# Altium project Analog_Multiplier.PrjPcb
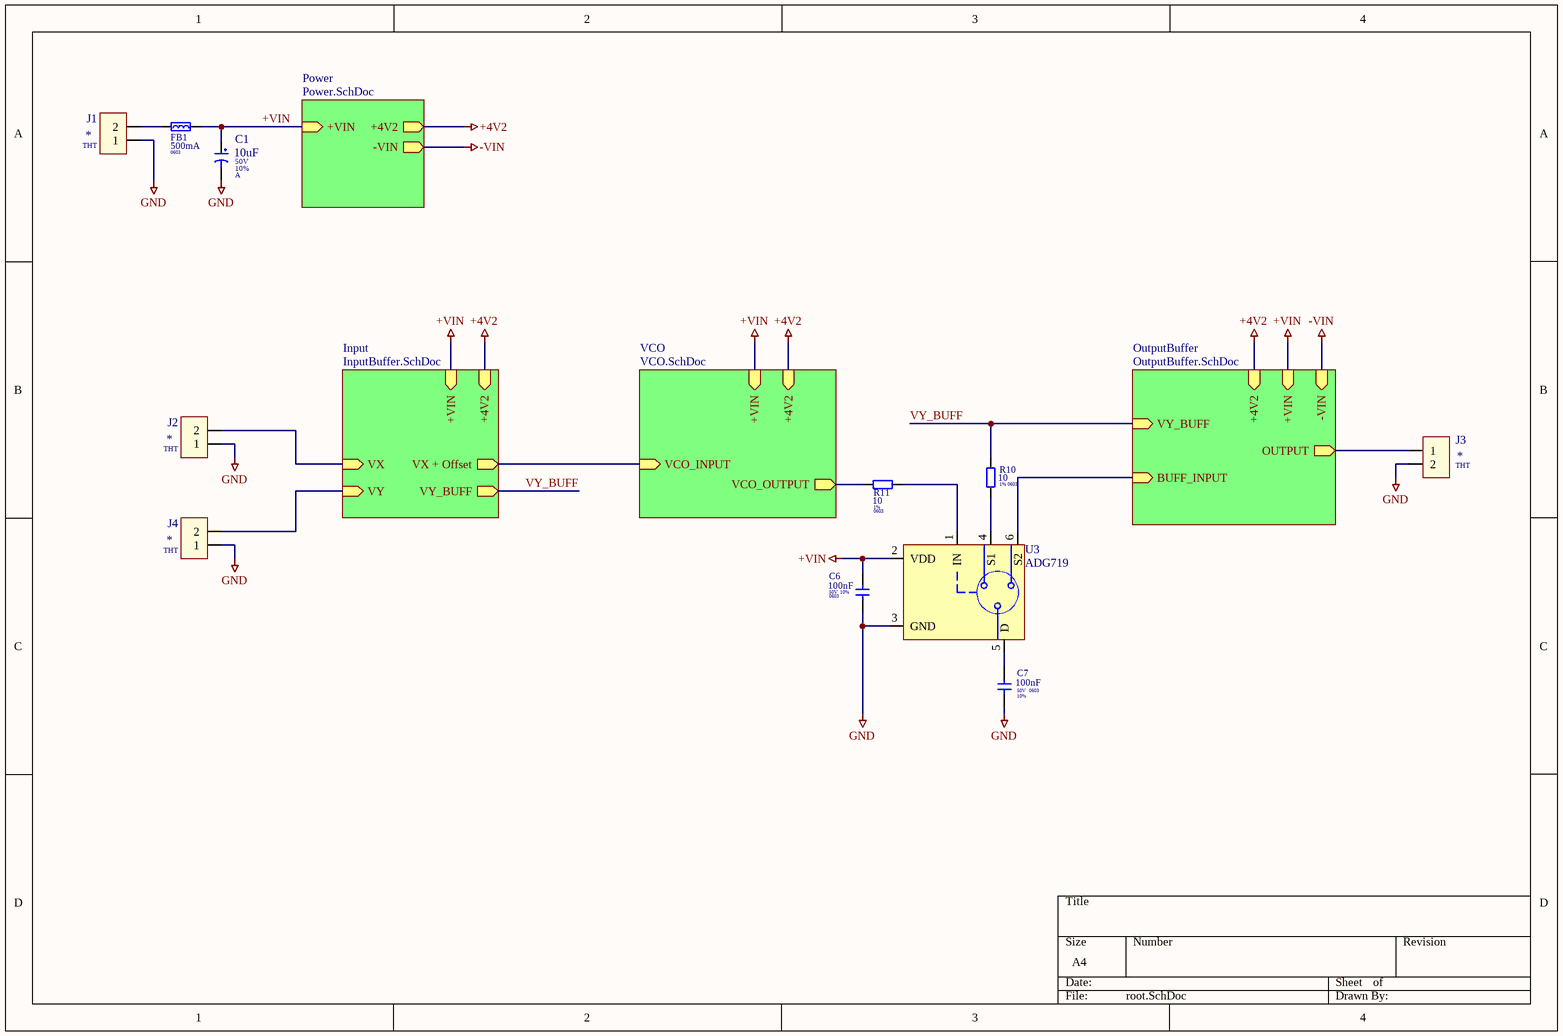
[diagram p0: root.SchDoc]
5 sheets, 67 parts. Net scope: hierarchical (ports join the sheet entries above them; power ports are global).
Sheets:
  root.SchDoc
    VCO = VCO.SchDoc
    Power = Power.SchDoc
    Input = InputBuffer.SchDoc
    OutputBuffer = OutputBuffer.SchDoc

## Sheet root.SchDoc
size A4; SheetNumber: 1; SheetTotal: 6

### Parts
C1  value 10uF  Voltage: 50V  Package: A  Tolerant: 10%  [CAPMP3217X16L]  (hidden comment: 10uF/50V)
C6  value 100nF  Voltage: 50V  Tolerant: 10%  Package: 0603  [CAPC1608X06M]  (hidden comment: 100nF/50V)
C7  value 100nF  Voltage: 50V  Tolerant: 10%  Package: 0603  [CAPC1608X06M]  (hidden comment: 100nF/50V)
FB1  Package: 0603  [INDC2012X07N]  (hidden comment: 500mA)
J1  Package: THT  [ARK2]  (hidden comment: *)
J2  Package: THT  [ARK2]  (hidden comment: *)
J3  Package: THT  [ARK2]  (hidden comment: *)
J4  Package: THT  [ARK2]  (hidden comment: *)
R10  value 10  Package: 0603  Tolerance: 1%  [RESC1608X06L]  (hidden comment: 10 1%)
R11  value 10  Package: 0603  Tolerance: 1%  [RESC1608X06L]  (hidden comment: 10 1%)
U3  ADG719  [SOT363/SC-88]

### Sub-sheets
Input = InputBuffer.SchDoc: VX (in), VX + Offset (out), +4V2 (in), +VIN (in), VY (in), VY_BUFF (out)
OutputBuffer = OutputBuffer.SchDoc: BUFF_INPUT (in), VY_BUFF (in), OUTPUT (out), +4V2 (in), +VIN (in), -VIN (in)
Power = Power.SchDoc: +VIN (in), +4V2 (out), -VIN (out)
VCO = VCO.SchDoc: +4V2 (in), +VIN (in), VCO_INPUT (in), VCO_OUTPUT (out)

### Nets
+4V2: sheet VCO/+4V2, sheet Power/+4V2, sheet Input/+4V2, sheet OutputBuffer/+4V2
+VIN: C1.1 C6.2 FB1.2 U3.2(VDD) ; sheet VCO/+VIN, sheet Power/+VIN, sheet Input/+VIN, sheet OutputBuffer/+VIN
-VIN: sheet Power/-VIN, sheet OutputBuffer/-VIN
GND: C1.2 C6.1 C7.1 J1.1 J2.1 J3.2 J4.1 U3.3(GND)
VY_BUFF: R10.2 ; sheet Input/VY_BUFF, sheet OutputBuffer/VY_BUFF
NetC7_2: C7.2 U3.5(D)
NetC14_1: U3.6(S2) ; sheet OutputBuffer/BUFF_INPUT
NetC17_2: J3.1 ; sheet OutputBuffer/OUTPUT
NetFB1_1: FB1.1 J1.2
NetJ2_2: J2.2 ; sheet Input/VX
NetJ4_2: J4.2 ; sheet Input/VY
NetQ1_2: R11.1 ; sheet VCO/VCO_OUTPUT
NetR4_1: sheet VCO/VCO_INPUT, sheet Input/VX + Offset
NetR10_1: R10.1 U3.4(S1)
NetR11_2: R11.2 U3.1(IN)

### Library data of the parts
C1 = C_TANTAL: WORKPLAN_Code: EP00; manufacture: *; helpurl: *
C6 C7 = C
FB1 = FB: manufacture: *; helpurl: *; value: 500mA
J1-J4 = CON_2PIN: WORKPLAN_Code: EP00; manufacture: *; helpurl: *; value: *
R10 R11 = R
U3 = ADG719: Analogue Switch ICs LOW VOLTAGE SINGEL SPDT; DataSheet: https://www.analog.com/media/en/technical-documentation/data-sheets/ADG719.pdf; Mouser: https://www.mouser.pl/ProductDetail/Analog-Devices/ADG719BRTZ-REEL7?qs=BpaRKvA4VqFaSWmiDs8izg%3D%3D&utm_id=20109199562&gad_source=1&gclid=Cj0KCQiA57G5BhDUARIsACgCYnxDS6CW5NFKHO1UnA1TKx4mLoyVdeZEORDHvH8gi9WRrzOxhw7N7oQaAhUnEALw_wcB; value: ADG719

## Sheet VCO.SchDoc
size A4; SheetNumber: 3; SheetTotal: 5
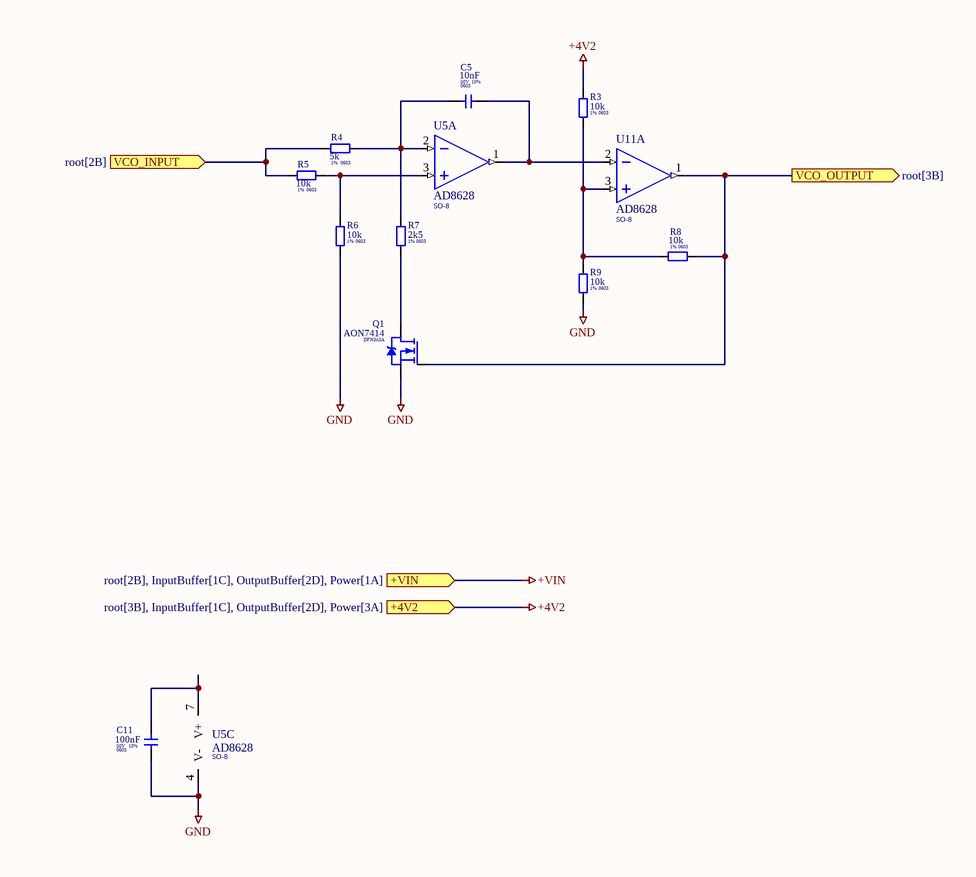
[diagram p1: VCO.SchDoc]

### Parts
C5  value 10nF  Voltage: 50V  Tolerant: 10%  Package: 0603  [CAPC1608X06M]  (hidden comment: 10nF/50V)
C11  value 100nF  Voltage: 50V  Tolerant: 10%  Package: 0603  [CAPC1608X06M]  (hidden comment: 100nF/50V)
Q1  Package: DFN3x3A  [SON65P300X90-3L]  (hidden comment: AON7414)
R3  value 10k  Package: 0603  Tolerance: 1%  [RESC1608X06L]  (hidden comment: 10k 1%)
R4  value 5k  Package: 0603  Tolerance: 1%  [RESC1608X06L]  (hidden comment: 5k 1%)
R5  value 10k  Package: 0603  Tolerance: 1%  [RESC1608X06L]  (hidden comment: 10k 1%)
R6  value 10k  Package: 0603  Tolerance: 1%  [RESC1608X06L]  (hidden comment: 10k 1%)
R7  value 2k5  Package: 0603  Tolerance: 1%  [RESC1608X06L]  (hidden comment: 2k5 1%)
R8  value 10k  Package: 0603  Tolerance: 1%  [RESC1608X06L]  (hidden comment: 10k 1%)
R9  value 10k  Package: 0603  Tolerance: 1%  [RESC1608X06L]  (hidden comment: 10k 1%)
U5  Package: SO-8  [SOIC127P600X170-8N]  (hidden comment: AD8628)  (parts A,C of 3)
U11  Package: SO-8  [SOIC127P600X170-8N]  (hidden comment: AD8628)  (part A of 3)

### Ports
+4V2 (in, see root[3B], InputBuffer[1C], OutputBuffer[2D], Power[3A]), +VIN (in, see root[2B], InputBuffer[1C], OutputBuffer[2D], Power[1A]), VCO_INPUT (in, see root[2B]), VCO_OUTPUT (out, see root[3B])

### Nets
+4V2: R3.2 ; port +4V2
GND: C11.1 Q1.1(S) R6.1 R9.1 U5.4(V-)
NetC5_1: C5.1 R4.2 R7.2 U5.2(IN-)
NetC5_2: C5.2 U5.1(OUT) U11.2(IN-)
NetC11_2: C11.2 U5.7(V+)
NetQ1_2: Q1.2(G) R8.1 U11.1(OUT) ; port VCO_OUTPUT
NetQ1_3: Q1.3(D) R7.1
NetR3_1: R3.1 R8.2 R9.2 U11.3(IN+)
NetR4_1: R4.1 R5.1 ; port VCO_INPUT
NetR5_2: R5.2 R6.2 U5.3(IN+)

### Library data of the parts
C5 C11 = C
Q1 = AON7414: 30V, 15A N-Channel MOSFET; manufacture: https://www.tme.eu/pl/details/aon7414/tranzystory-z-kanalem-n-smd/alpha-omega-semiconductor/; helpurl: https://www.tme.eu/Document/bbe6d91c24f2d151d9c9588885823e7b/AON7414-DTE.pdf; value: AON7414
R3-R9 = R
U5 U11 = AD8628ARZ: Zero-Drift, Single-Supply, Rail-to-Rail Input/Output Operational Amplifier; Manufacture: Analog; helpurl: https://www.analog.com/media/en/technical-documentation/data-sheets/ad8628-8629-8630.pdf; value: AD8628

## Sheet Power.SchDoc
size A4; SheetNumber: 2; SheetTotal: 5
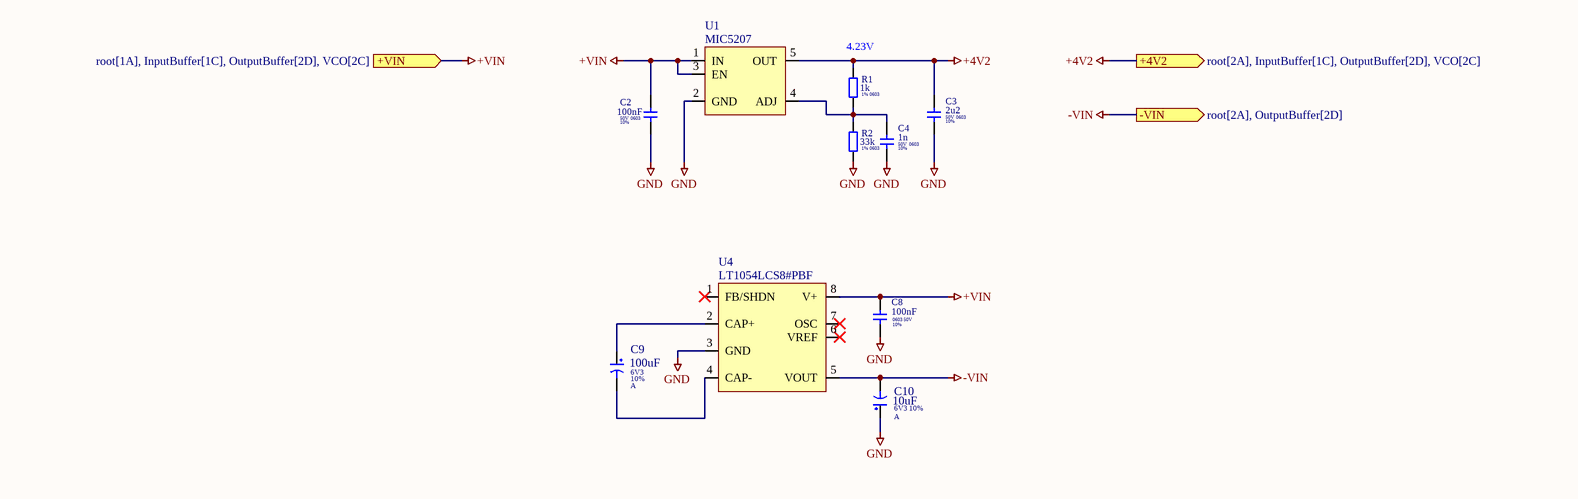
[diagram p2: Power.SchDoc]

### Parts
C2  value 100nF  Voltage: 50V  Tolerant: 10%  Package: 0603  [CAPC1608X06M]  (hidden comment: 100nF/50V)
C3  value 2u2  Voltage: 50V  Tolerant: 10%  Package: 0603  [CAPC1608X06M]  (hidden comment: 2u2/50V)
C4  value 1n  Voltage: 50V  Tolerant: 10%  Package: 0603  [CAPC1608X06M]  (hidden comment: 1n/50V)
C8  value 100nF  Voltage: 50V  Tolerant: 10%  Package: 0603  [CAPC1608X06M]  (hidden comment: 100nF/50V)
C9  value 100uF  Voltage: 6V3  Package: A  Tolerant: 10%  [CAPMP3217X16L]  (hidden comment: 100uF/6V3)
C10  value 10uF  Voltage: 6V3  Package: A  Tolerant: 10%  [CAPMP3217X16L]  (hidden comment: 10uF/6V3)
R1  value 1k  Package: 0603  Tolerance: 1%  [RESC1608X06L]  (hidden comment: 1k 1%)
R2  value 33k  Package: 0603  Tolerance: 1%  [RESC1608X06L]  (hidden comment: 33k 1%)
U1  MIC5207  [SOT95P245X110-5M]
U4  LT1054LCS8#PBF  [SOIC-8]

### Ports
+4V2 (out, see root[2A], InputBuffer[1C], OutputBuffer[2D], VCO[2C]), +VIN (in, see root[1A], InputBuffer[1C], OutputBuffer[2D], VCO[2C]), -VIN (out, see root[2A], OutputBuffer[2D])

### Nets
+4V2: C3.2 R1.2 U1.5(OUT) ; port +4V2
+VIN: C2.2 C8.2 U1.1(IN) U1.3(EN) U4.8(V+) ; port +VIN
-VIN: C10.2 U4.5(VOUT) ; port -VIN
GND: C2.1 C3.1 C4.1 C8.1 C10.1 R2.1 U1.2(GND) U4.3(GND)
NetC4_2: C4.2 R1.1 R2.2 U1.4(ADJ)
NetC9_1: C9.1 U4.2(CAP+)
NetC9_2: C9.2 U4.4(CAP-)

Not connected (* = marked no-connect by the designer): U4 1(FB/SHDN)* 6(VREF)* 7(OSC)*

### Notes on the sheet
- (near R1) 4.23V

### Library data of the parts
C2-C4 C8 = C
C9 C10 = C_TANTAL: WORKPLAN_Code: EP00; manufacture: *; helpurl: *
R1 R2 = R
U1 = MIC5207YM5-TR: 180 mA Low-Noise LDO Regulator; Manufacture: Microchip; helpurl: https://ww1.microchip.com/downloads/aemDocuments/documents/APID/ProductDocuments/DataSheets/MIC5207-180mA-Low-Noise-LDO-Regulator-DS20005719C.pdf; value: MIC5207
U4 = LT1054: Switched-Capacitor Voltage / Converter with Regulator; Manufacturer: AnalogDevices; DataSheet: https://www.mouser.pl/datasheet/2/609/LT1054_1054L-1775938.pdf; Mouser: https://www.mouser.pl/ProductDetail/Analog-Devices/LT1054LCS8PBF?qs=ytflclh7QUUfK4FckUJTaA%3D%3D; value: LT1054LCS8#PBF

## Sheet InputBuffer.SchDoc
size A4; SheetNumber: 4; SheetTotal: 6
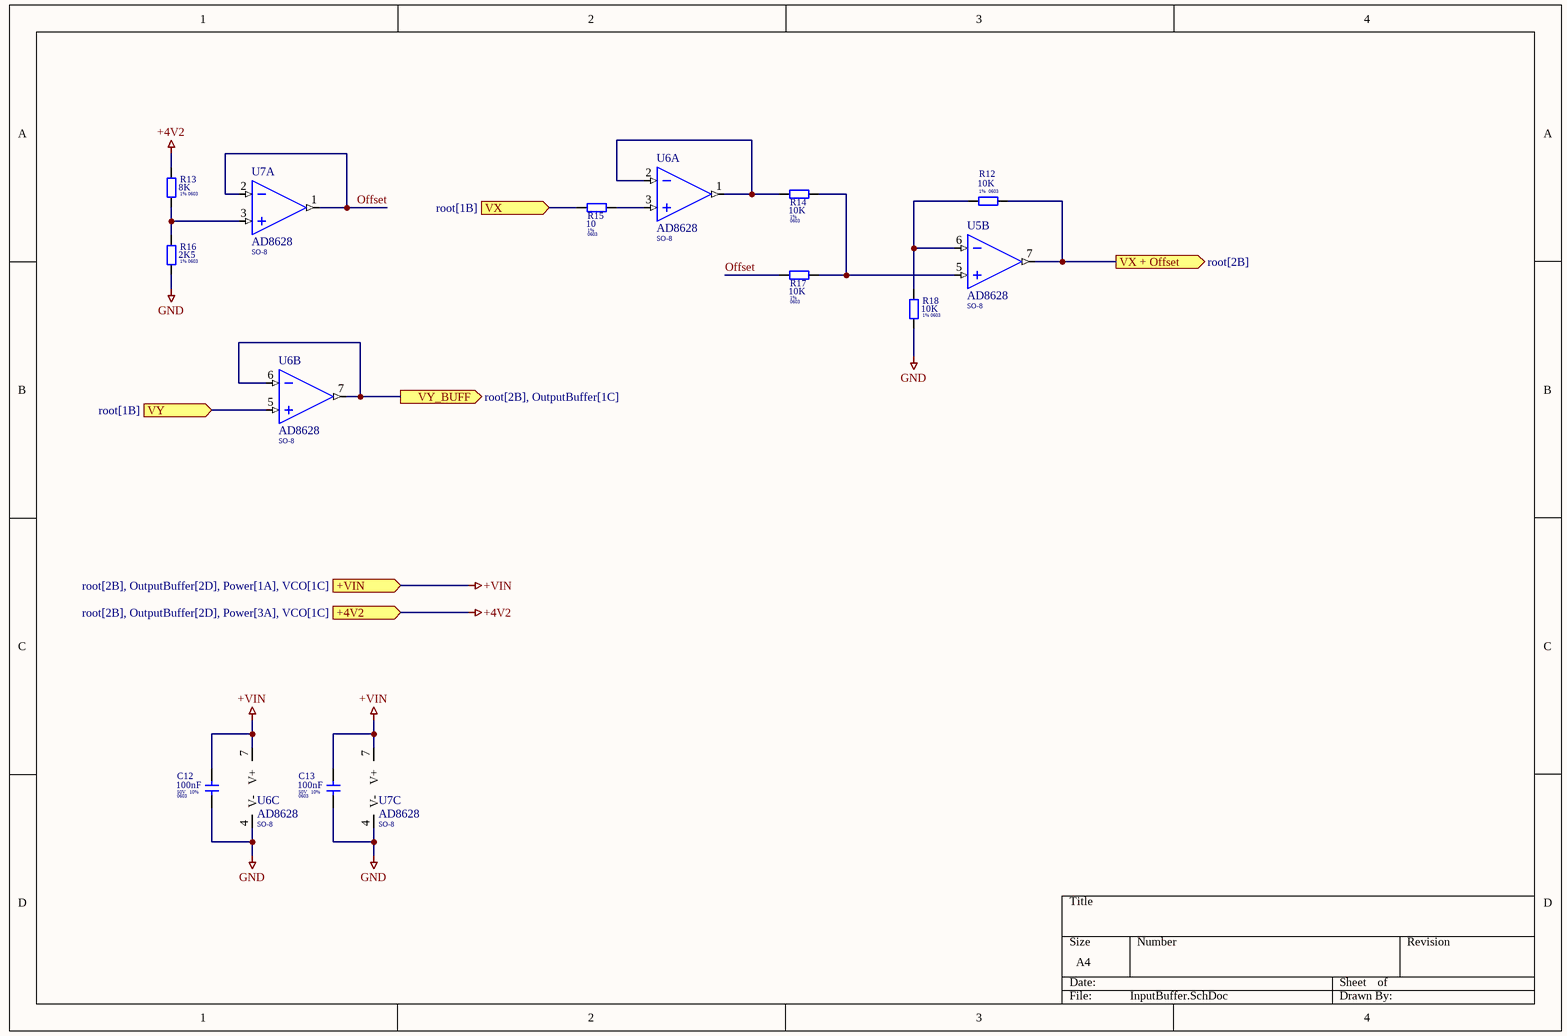
[diagram p3: InputBuffer.SchDoc]

### Parts
C12  value 100nF  Voltage: 50V  Tolerant: 10%  Package: 0603  [CAPC1608X06M]  (hidden comment: 100nF/50V)
C13  value 100nF  Voltage: 50V  Tolerant: 10%  Package: 0603  [CAPC1608X06M]  (hidden comment: 100nF/50V)
R12  value 10K  Package: 0603  Tolerance: 1%  [RESC1608X06L]  (hidden comment: 10K 1%)
R13  value 8K  Package: 0603  Tolerance: 1%  [RESC1608X06L]  (hidden comment: 8K 1%)
R14  value 10K  Package: 0603  Tolerance: 1%  [RESC1608X06L]  (hidden comment: 10K 1%)
R15  value 10  Package: 0603  Tolerance: 1%  [RESC1608X06L]  (hidden comment: 10 1%)
R16  value 2K5  Package: 0603  Tolerance: 1%  [RESC1608X06L]  (hidden comment: 2K5 1%)
R17  value 10K  Package: 0603  Tolerance: 1%  [RESC1608X06L]  (hidden comment: 10K 1%)
R18  value 10K  Package: 0603  Tolerance: 1%  [RESC1608X06L]  (hidden comment: 10K 1%)
U5  Package: SO-8  [SOIC127P600X170-8N]  (hidden comment: AD8628)  (part B of 3)
U6  Package: SO-8  [SOIC127P600X170-8N]  (hidden comment: AD8628)  (parts A,B,C of 3)
U7  Package: SO-8  [SOIC127P600X170-8N]  (hidden comment: AD8628)  (parts A,C of 3)

### Ports
+4V2 (in, see root[2B], OutputBuffer[2D], Power[3A], VCO[1C]), +VIN (in, see root[2B], OutputBuffer[2D], Power[1A], VCO[1C]), VX (in, see root[1B]), VX + Offset (out, see root[2B]), VY (in, see root[1B]), VY_BUFF (out, see root[2B], OutputBuffer[1C])

### Nets
+4V2: R13.2 ; port +4V2
+VIN: C12.2 C13.2 U6.7(V+) U7.7(V+) ; port +VIN
GND: C12.1 C13.1 R16.1 R18.1 U6.4(V-) U7.4(V-)
Offset: R17.1 U7.1(OUT) U7.2(IN-)
VY_BUFF: U6.6(IN-) U6.7(OUT) ; port VY_BUFF
NetJ2_2: R15.1 ; port VX
NetJ4_2: U6.5(IN+) ; port VY
NetR4_1: R12.2 U5.7(OUT) ; port VX + Offset
NetR12_1: R12.1 R18.2 U5.6(IN-)
NetR13_1: R13.1 R16.2 U7.3(IN+)
NetR14_1: R14.1 U6.1(OUT) U6.2(IN-)
NetR14_2: R14.2 R17.2 U5.5(IN+)
NetR15_2: R15.2 U6.3(IN+)

### Library data of the parts
C12 C13 = C
R12-R18 = R
U5-U7 = AD8628ARZ: as U5 on sheet VCO; helpurl: https://www.analog.com/media/en/technical-documentation/data-sheets/ad8628-8629-8630.pdf; value: AD8628

## Sheet OutputBuffer.SchDoc
size A4; SheetNumber: 5; SheetTotal: 5
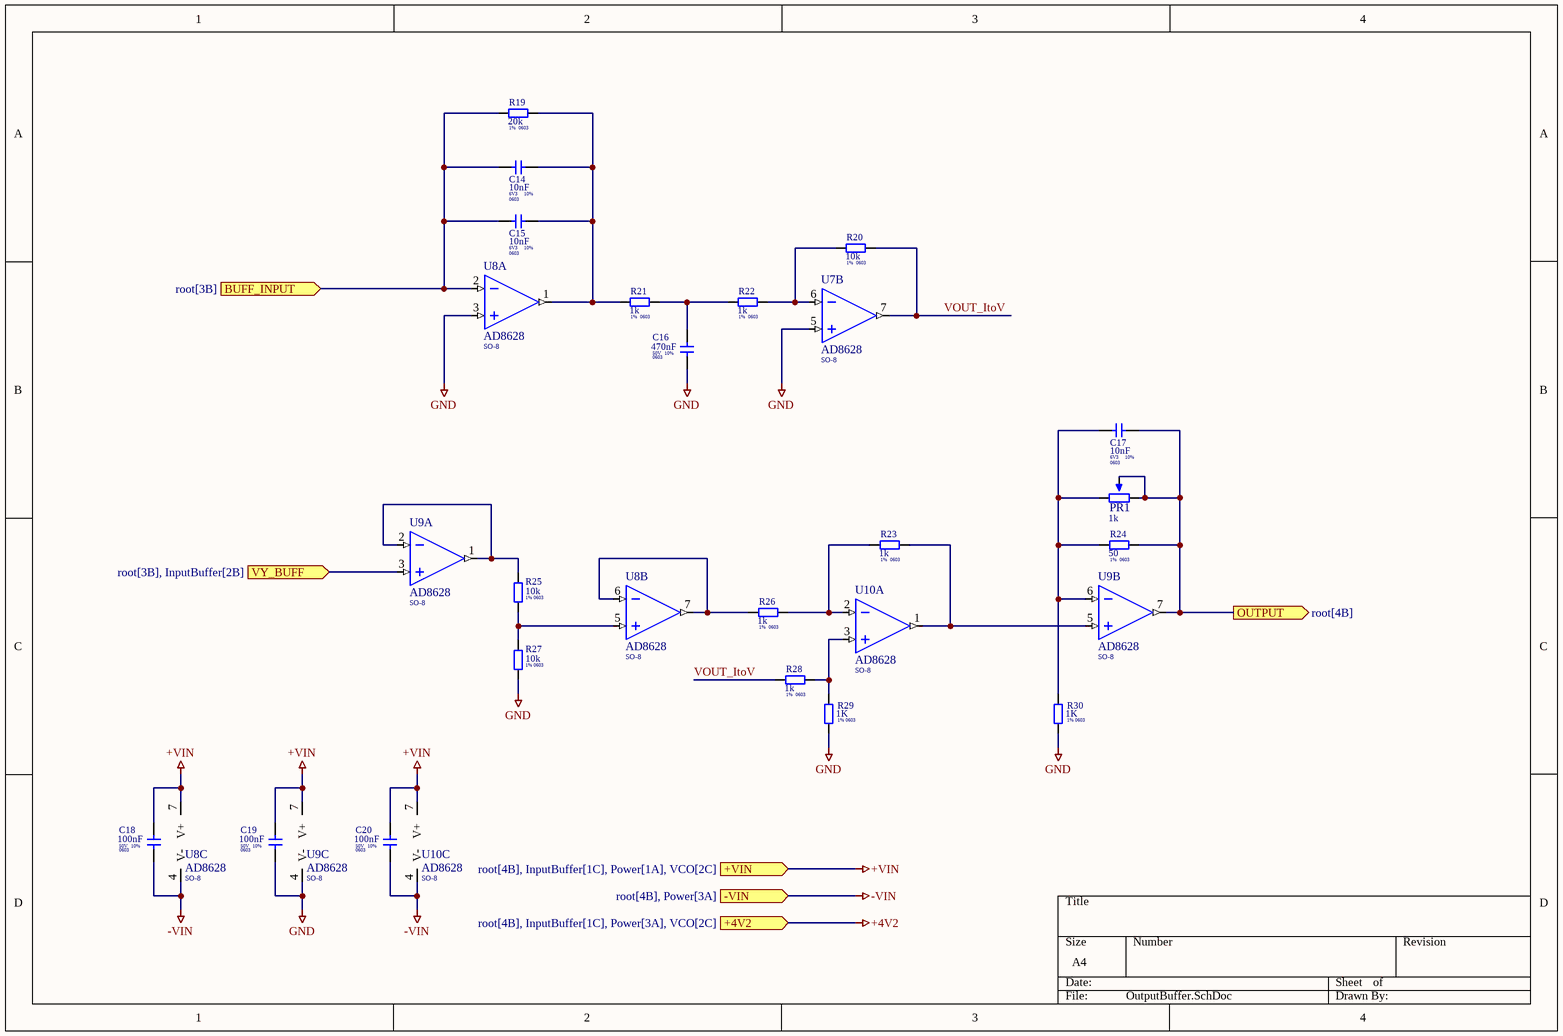
[diagram p4: OutputBuffer.SchDoc]

### Parts
C14  value 10nF  Voltage: 6V3  Tolerant: 10%  Package: 0603  [CAPC1608X06M]  (hidden comment: 10nF/6V3)
C15  value 10nF  Voltage: 6V3  Tolerant: 10%  Package: 0603  [CAPC1608X06M]  (hidden comment: 10nF/6V3)
C16  value 470nF  Voltage: 50V  Tolerant: 10%  Package: 0603  [CAPC1608X06M]  (hidden comment: 470nF/50V)
C17  value 10nF  Voltage: 6V3  Tolerant: 10%  Package: 0603  [CAPC1608X06M]  (hidden comment: 10nF/6V3)
C18  value 100nF  Voltage: 50V  Tolerant: 10%  Package: 0603  [CAPC1608X06M]  (hidden comment: 100nF/50V)
C19  value 100nF  Voltage: 50V  Tolerant: 10%  Package: 0603  [CAPC1608X06M]  (hidden comment: 100nF/50V)
C20  value 100nF  Voltage: 50V  Tolerant: 10%  Package: 0603  [CAPC1608X06M]  (hidden comment: 100nF/50V)
PR1  1k  [PR_TRIM]
R19  value 20k  Package: 0603  Tolerance: 1%  [RESC1608X06L]  (hidden comment: 20k 1%)
R20  value 10k  Package: 0603  Tolerance: 1%  [RESC1608X06L]  (hidden comment: 10k 1%)
R21  value 1k  Package: 0603  Tolerance: 1%  [RESC1608X06L]  (hidden comment: 1k 1%)
R22  value 1k  Package: 0603  Tolerance: 1%  [RESC1608X06L]  (hidden comment: 1k 1%)
R23  value 1k  Package: 0603  Tolerance: 1%  [RESC1608X06L]  (hidden comment: 1k 1%)
R24  value 50  Package: 0603  Tolerance: 1%  [RESC1608X06L]  (hidden comment: 50 1%)
R25  value 10k  Package: 0603  Tolerance: 1%  [RESC1608X06L]  (hidden comment: 10k 1%)
R26  value 1k  Package: 0603  Tolerance: 1%  [RESC1608X06L]  (hidden comment: 1k 1%)
R27  value 10k  Package: 0603  Tolerance: 1%  [RESC1608X06L]  (hidden comment: 10k 1%)
R28  value 1k  Package: 0603  Tolerance: 1%  [RESC1608X06L]  (hidden comment: 1k 1%)
R29  value 1K  Package: 0603  Tolerance: 1%  [RESC1608X06L]  (hidden comment: 1K 1%)
R30  value 1K  Package: 0603  Tolerance: 1%  [RESC1608X06L]  (hidden comment: 1K 1%)
U7  Package: SO-8  [SOIC127P600X170-8N]  (hidden comment: AD8628)  (part B of 3)
U8  Package: SO-8  [SOIC127P600X170-8N]  (hidden comment: AD8628)  (parts A,B,C of 3)
U9  Package: SO-8  [SOIC127P600X170-8N]  (hidden comment: AD8628)  (parts A,B,C of 3)
U10  Package: SO-8  [SOIC127P600X170-8N]  (hidden comment: AD8628)  (parts A,C of 3)

### Ports
+4V2 (in, see root[4B], InputBuffer[1C], Power[3A], VCO[2C]), +VIN (in, see root[4B], InputBuffer[1C], Power[1A], VCO[2C]), -VIN (in, see root[4B], Power[3A]), BUFF_INPUT (in, see root[3B]), OUTPUT (out, see root[4B]), VY_BUFF (in, see root[3B], InputBuffer[2B])

### Nets
+VIN: C18.2 C19.2 C20.2 U8.7(V+) U9.7(V+) U10.7(V+) ; port +VIN
-VIN: C18.1 C20.1 U8.4(V-) U10.4(V-) ; port -VIN
GND: C16.1 C19.1 R27.1 R29.1 R30.1 U7.5(IN+) U8.3(IN+) U9.4(V-)
VOUT_ItoV: R20.2 R28.1 U7.7(OUT)
VY_BUFF: U9.3(IN+) ; port VY_BUFF
NetC14_1: C14.1 C15.1 R19.1 U8.2(IN-) ; port BUFF_INPUT
NetC14_2: C14.2 C15.2 R19.2 R21.1 U8.1(OUT)
NetC16_2: C16.2 R21.2 R22.1
NetC17_1: C17.1 PR1.1 R24.1 R30.2 U9.6(IN-)
NetC17_2: C17.2 PR1.2 PR1.3 R24.2 U9.7(OUT) ; port OUTPUT
NetR20_1: R20.1 R22.2 U7.6(IN-)
NetR23_1: R23.1 R26.2 U10.2(IN-)
NetR23_2: R23.2 U9.5(IN+) U10.1(OUT)
NetR25_1: R25.1 R27.2 U8.5(IN+)
NetR25_2: R25.2 U9.1(OUT) U9.2(IN-)
NetR26_1: R26.1 U8.6(IN-) U8.7(OUT)
NetR28_2: R28.2 R29.2 U10.3(IN+)

### Library data of the parts
C14-C20 = C
PR1 = R_PR: VALUE: 1k
R19-R30 = R
U7-U10 = AD8628ARZ: as U5 on sheet VCO; helpurl: https://www.analog.com/media/en/technical-documentation/data-sheets/ad8628-8629-8630.pdf; value: AD8628

## Nets that join several sheets
+4V2: VCO (R3.2), Power (C3.2 R1.2 U1.5), InputBuffer (R13.2)
+VIN: root (C1.1 C6.2 FB1.2 U3.2), Power (5 pins), InputBuffer (C12.2 C13.2 U6.7 U7.7), OutputBuffer (6 pins)
-VIN: Power (C10.2 U4.5), OutputBuffer (C18.1 C20.1 U8.4 U10.4)
GND: root (8 pins), VCO (5 pins), Power (8 pins), InputBuffer (6 pins), OutputBuffer (8 pins)
NetC14_1: root (U3.6), OutputBuffer (C14.1 C15.1 R19.1 U8.2)
NetC17_2: root (J3.1), OutputBuffer (5 pins)
NetJ2_2: root (J2.2), InputBuffer (R15.1)
NetJ4_2: root (J4.2), InputBuffer (U6.5)
NetQ1_2: root (R11.1), VCO (Q1.2 R8.1 U11.1)
NetR4_1: VCO (R4.1 R5.1), InputBuffer (R12.2 U5.7)
VY_BUFF: root (R10.2), InputBuffer (U6.6 U6.7), OutputBuffer (U9.3)